# EAGLE design source_led (EAGLE 9.6.2)
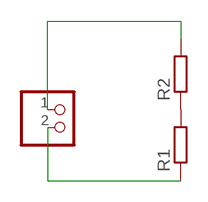
[diagram p0: schematic, sheet 1]

## Parts
JP1  PINHD-1X2  [1X02]
R1  R-EU_0204/7  [0204/7]
R2  R-EU_0204/7  [0204/7]

## Nets
N$1: JP1.2 R1.1
N$2: JP1.1 R2.2
N$3: R1.2 R2.1

## Library data of the parts
JP1 = pinhead:PINHD-1X2: PIN HEADER
R1 R2 = rcl:R-EU_: RESISTOR, European symbol; SPICEPREFIX: R

## Board
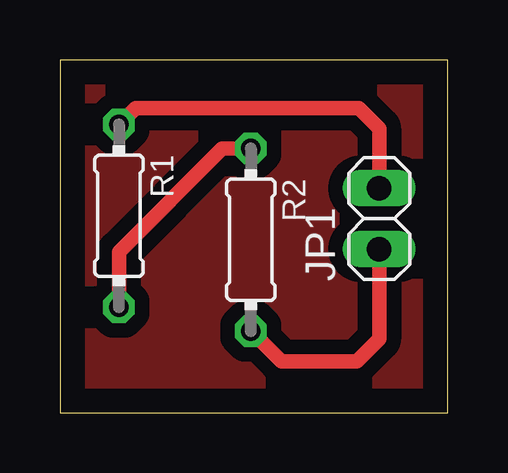
[diagram p1: board, top side]

Size 16.18 x 14.72 mm. Coordinates in mm from the lower left corner, seen from the top.
Outline: 0,0 16.18,0 16.18,14.72 0,14.72 0,0
Copper layers (1*16): Top 0.035mm / dielectric 1.5mm / Bottom 0.035mm
Design rules "default": minimum track width 6mil, minimum drill 0.35mm, track to track 6mil, track to pad 6mil, pad to pad 6mil, via to via 6mil, smd to smd 6mil, copper to edge 40mil, drill to drill 6mil, minimum pad ring 10mil, minimum via ring 8mil, stop-mask expansion 4mil, vias tented up to drill 0mil, thermal gap 10mil

### Footprints (pad centres in the part's own frame; a part is rotated, then mirrored left to right if it is on the bottom)
1X02 = drill 1.016 long: 1 -1.27,0; 2 1.27,0
0204/7 = drill 0.813 octagon: 1 -3.81,0; 2 3.81,0

### Placement (x,y rotation side)
JP1  13.32,8.1 90 top
R1  2.46,8.22 270 top
R2  7.96,7.22 270 top

### Tracks (layer width: path | path; a pad name or v marks a point on that pad's centre or on a via)
GND
  pour Top (isolate 0.61): -0.04,13.72 -0.04,1.72 1.46,0.22 14.96,0.22 16.46,1.72 16.46,13.22 14.96,14.72 0.96,14.72
N$1
  Top 0.61: R1.1 3.15,12.72 12.46,12.72 13.32,11.86 JP1.2
N$2
  Top 0.61: JP1.1 13.32,3.08 12.38,2.14 9.23,2.14 R2.2
N$3
  Top 0.61: R1.2 2.46,6.72 6.77,11.03 R2.1